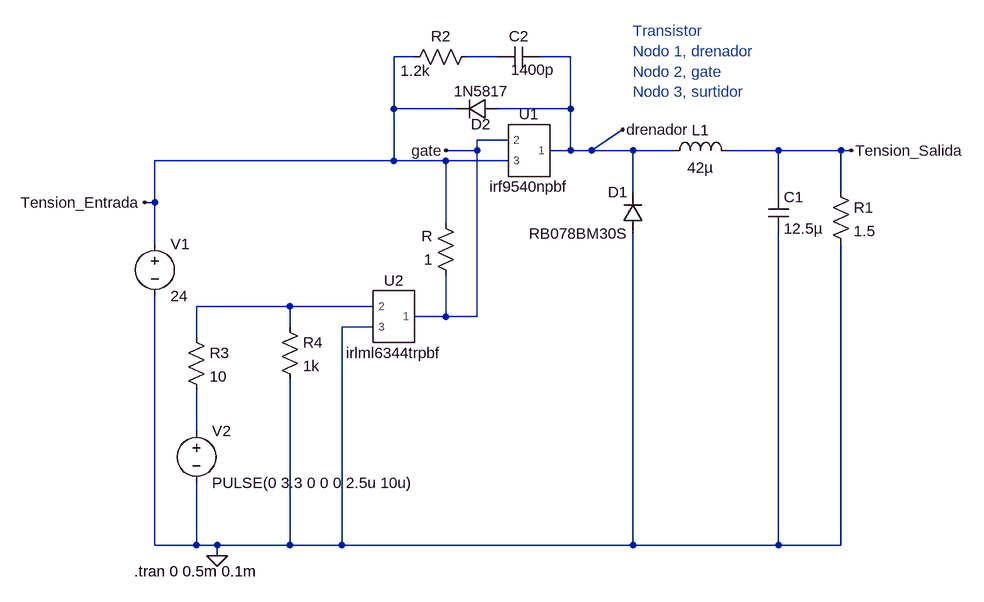
[diagram p0: schematic buck_mosfet.asc]
buck_mosfet.asc, the LTspice schematic file:
Version 4.1
SHEET 1 1456 776
WIRE 336 -32 304 -32
WIRE 464 -32 416 -32
WIRE 576 -32 528 -32
WIRE 304 48 304 -32
WIRE 400 48 304 48
WIRE 576 48 576 -32
WIRE 576 48 464 48
WIRE 480 96 432 96
WIRE 432 112 432 96
WIRE 432 112 384 112
WIRE 576 112 576 48
WIRE 576 112 544 112
WIRE 608 112 656 80
WIRE 608 112 576 112
WIRE 672 112 608 112
WIRE 736 112 672 112
WIRE 896 112 816 112
WIRE 992 112 896 112
WIRE 1008 112 992 112
WIRE 304 128 304 48
WIRE 304 128 -64 128
WIRE 384 128 304 128
WIRE 480 128 384 128
WIRE 672 176 672 112
WIRE 896 176 896 112
WIRE 992 176 992 112
WIRE -64 192 -64 128
WIRE -64 192 -80 192
WIRE 384 224 384 128
WIRE -64 256 -64 192
WIRE 144 352 0 352
WIRE 272 352 144 352
WIRE 384 368 384 304
WIRE 384 368 336 368
WIRE 432 368 432 112
WIRE 432 368 384 368
WIRE 144 384 144 352
WIRE 272 384 224 384
WIRE 0 400 0 352
WIRE 0 544 0 480
WIRE -64 720 -64 336
WIRE 0 720 0 624
WIRE 0 720 -64 720
WIRE 32 720 0 720
WIRE 144 720 144 464
WIRE 144 720 32 720
WIRE 224 720 224 384
WIRE 224 720 144 720
WIRE 672 720 672 240
WIRE 672 720 224 720
WIRE 896 720 896 240
WIRE 896 720 672 720
WIRE 992 720 992 256
WIRE 992 720 896 720
WIRE 32 736 32 720
FLAG 32 736 0
FLAG 1008 112 Tension_Salida
FLAG -80 192 Tension_Entrada
FLAG 384 112 gate
FLAG 656 80 drenador
SYMBOL diode 688 240 R180
WINDOW 0 24 64 Left 2
WINDOW 3 24 0 Left 2
SYMATTR InstName D1
SYMATTR Value RB078BM30S
SYMBOL res 976 160 R0
SYMATTR InstName R1
SYMATTR Value 1.5
SYMBOL voltage -64 240 R0
WINDOW 123 0 0 Left 0
WINDOW 39 0 0 Left 0
SYMATTR InstName V1
SYMATTR Value 24
SYMBOL voltage 0 528 R0
WINDOW 123 0 0 Left 0
WINDOW 39 0 0 Left 0
SYMATTR InstName V2
SYMATTR Value PULSE(0 3.3 0 0 0 2.5u 10u)
SYMBOL ind 720 128 R270
WINDOW 0 32 56 VTop 2
WINDOW 3 5 56 VBottom 2
SYMATTR InstName L1
SYMATTR Value 42µ
SYMBOL cap 880 176 R0
SYMATTR InstName C1
SYMATTR Value 12.5µ
SYMBOL res 432 -48 R90
WINDOW 0 0 56 VBottom 2
WINDOW 3 22 95 VTop 2
SYMATTR InstName R2
SYMATTR Value 1.2k
SYMBOL cap 528 -48 R90
WINDOW 0 0 32 VBottom 2
WINDOW 3 20 10 VTop 2
SYMATTR InstName C2
SYMATTR Value 1400p
SYMBOL diode 464 32 R90
WINDOW 0 55 26 VBottom 2
WINDOW 3 -27 25 VTop 2
SYMATTR InstName D2
SYMATTR Value 1N5817
SYMBOL res 400 320 R180
WINDOW 0 36 76 Left 2
WINDOW 3 36 40 Left 2
SYMATTR InstName R
SYMATTR Value 1
SYMBOL res 128 368 R0
SYMATTR InstName R4
SYMATTR Value 1k
SYMBOL res -16 384 R0
SYMATTR InstName R3
SYMATTR Value 10
SYMBOL irf9540npbf 512 112 M0
SYMATTR InstName U1
SYMBOL irlml6344trpbf_win 304 368 M0
SYMATTR InstName U2
TEXT -96 760 Left 2 !.tran 0 0.5m 0.1m
TEXT 672 -72 Left 2 ;Transistor\nNodo 1, drenador\nNodo 2, gate\nNodo 3, surtidor

The netlist it stands for:
* buck_mosfet.asc
D1 0 drenador RB078BM30S
R1 Tension_Salida 0 1.5
V1 Tension_Entrada 0 24
V2 N003 0 PULSE(0 3.3 0 0 0 2.5u 10u)
L1 drenador Tension_Salida 42µ
C1 Tension_Salida 0 12.5µ
R2 N001 Tension_Entrada 1.2k
C2 drenador N001 1400p
D2 drenador Tension_Entrada 1N5817
R gate Tension_Entrada 1
R4 N002 0 1k
R3 N002 N003 10
X§U1 drenador gate Tension_Entrada irf9540npbf  ; pins 1 2 3
X§U2 gate N002 0 irlml6344trpbf  ; pins 1 2 3
.model D D
.lib standard.dio
.tran 0 0.5m 0.1m
* Transistor
* Nodo 1, drenador
* Nodo 2, gate
* Nodo 3, surtidor
.lib D:\RepositorioGitHub\ProyectoFinal\Prototipos\Buck #1\Simulación\Modelos_spice\Infineon-Spice File-IRF9540NPBF-SM-v01_00-EN.spi
.lib D:\RepositorioGitHub\ProyectoFinal\Prototipos\Buck #1\Simulación\Modelos_spice\IRLML6344.spi
.backanno
.end